# EAGLE design carrier (EAGLE 6.6.0)
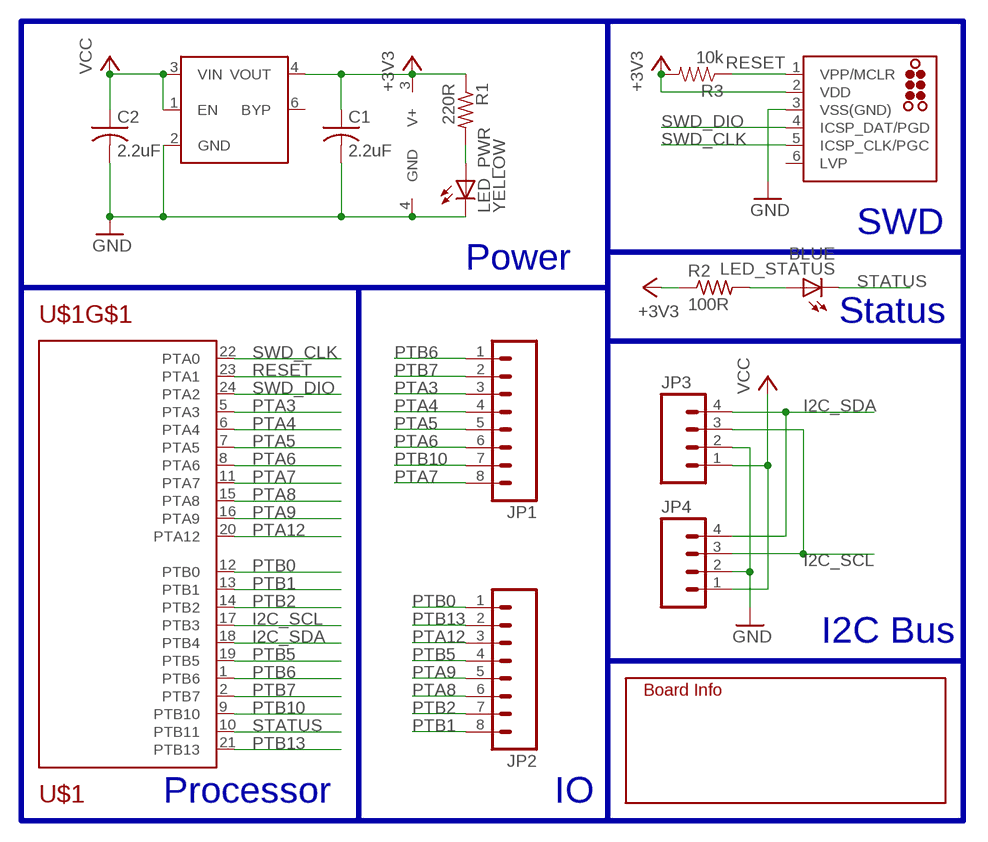
[diagram p0: schematic, sheet 1]

## Parts
C1  2.2uF  C-USC0402  [C0402]
C2  2.2uF  C-USC0402  [C0402]
J1  TC2030-MCP-NL  [TC2030-MCP-NL]
JP1  M081X08  [1X08]
JP2  M081X08  [1X08]
JP3  M04PTH  [1X04]
JP4  M04PTH  [1X04]
LED_PWR  YELLOW  LEDSML0603  [SML0603]
LED_STATUS  BLUE  LEDSML0603  [SML0603]
R1  220R  R-US_R0402  [R0402]
R2  100R  R-US_R0402  [R0402]
R3  10k  RESISTOR0402-RES  [0402-RES]
U$1  MKL05Z32VFK4-QFN  [QFN-24]
U$2  MIC5305-MLF  [MLF-6]
U$3  INFO  [INFO]

## Nets
+3V3: C1.1 J1.2(VDD) R1.1 R2.1 R3.2 U$1.3(V+) U$2.4(VOUT)
GND: C1.2 C2.2 J1.3(VSS(GND)) JP3.2 JP4.2 LED_PWR.C U$1.4(GND) U$2.2(GND)
I2C_SCL: JP3.3 JP4.3 U$1.17(PTB3)
I2C_SDA: JP3.4 JP4.4 U$1.18(PTB4)
N$1: LED_PWR.A R1.2
N$2: LED_STATUS.A R2.2
PTA3: JP1.3 U$1.5(PTA3)
PTA4: JP1.4 U$1.6(PTA4)
PTA5: JP1.5 U$1.7(PTA5)
PTA6: JP1.6 U$1.8(PTA6)
PTA7: JP1.8 U$1.11(PTA7)
PTA8: JP2.6 U$1.15(PTA8)
PTA9: JP2.5 U$1.16(PTA9)
PTA12: JP2.3 U$1.20(PTA12)
PTB0: JP2.1 U$1.12(PTB0)
PTB1: JP2.8 U$1.13(PTB1)
PTB2: JP2.7 U$1.14(PTB2)
PTB5: JP2.4 U$1.19(PTB5)
PTB6: JP1.1 U$1.1(PTB6)
PTB7: JP1.2 U$1.2(PTB7)
PTB10: JP1.7 U$1.9(PTB10)
PTB13: JP2.2 U$1.21(PTB13)
RESET: J1.1(VPP/MCLR) R3.1 U$1.23(PTA1)
STATUS: LED_STATUS.C U$1.10(PTB11)
SWD_CLK: J1.5(ICSP_CLK/PGC) U$1.22(PTA0)
SWD_DIO: J1.4(ICSP_DAT/PGD) U$1.24(PTA2)
VCC: C2.1 JP3.1 JP4.1 U$2.1(EN) U$2.3(VIN)
Unconnected: J1.6(LVP) U$2.6(BYP)

## Buses
B$1

## Notes on the sheet
- SWD
- Power
- Status
- I2C Bus
- Processor | IO

## Library data of the parts
C1 C2 = rcl:C-US: CAPACITOR, American symbol
J1 = tag-connect:TC2030: TAG-CONNECT ICSP Connector Manufacturer: Tag-Connect <http://www.tag-connect.com> Cable for easy In-Circuit Serial Programming. Designed for Microchip ICD2, suitable for many others. Two variants - one "with legs" (for hands-free fit on PCB) and another "without legs" for quick programming. PAD Description 1 MCLR/Vpp 2 Vdd 3 GND 4 PGD (ISPDAT) 5 PGC (ISPCLK) 6 nc (used for LVP) ©2009 ROFA.cz - modified and updated by Robert Darlington ‹rdarlington@gmail.com›
JP1 JP2 = SparkFun-Connectors:M08: Header 8 Standard 8-pin 0.1" header. Use with straight break away headers (SKU : PRT-00116), right angle break away headers (PRT-00553), swiss pins (PRT-00743), machine pins (PRT-00117), and female headers (PRT-00115).
JP3 JP4 = SparkFun-Connectors:M04: Header 4 Standard 4-pin 0.1" header. Use with straight break away headers (SKU : PRT-00116), right angle break away headers (PRT-00553), swiss pins (PRT-00743), machine pins (PRT-00117), and female headers (PRT-00115). Molex polarized connector foot print use with SKU : PRT-08231 with associated crimp pins and housings. 1MM SMD Version SKU: PRT-10208
LED_PWR LED_STATUS = led:LED: LED OSRAM: - CHIPLED LG R971, LG N971, LY N971, LG Q971, LY Q971, LO R971, LY R971 LH N974, LH R974 LS Q976, LO Q976, LY Q976 LO Q996 - Hyper CHIPLED LW Q18S LB Q993, LB Q99A, LB R99A - SideLED LS A670, LO A670, LY A670, LG A670, LP A670 LB A673, LV A673, LT A673, LW A673 LH A674 LY A675 LS A676, LA A676, LO A676, LY A676, LW A676 LS A679, LY A679, LG A679 - Hyper Micro SIDELED® LS Y876, LA Y876, LO Y876, LY Y876 LT Y87S - SmartLED LW L88C, LW L88S LB L89C, LB L89S, LG L890 LS L89K, LO L89K, LY L89K LS L896, LA L896, LO L896, LY L896 - TOPLED LS T670, LO T670, LY T670, LG T670, LP T670 LSG T670, LSP T670, LSY T670, LOP T670, LYG T670 LG T671, LOG T671, LSG T671 LB T673, LV T673, LT T673, LW T673 LH T674 LS T676, LA T676, LO T676, LY T676, LB T676, LH T676, LSB T676, LW T676 LB T67C, LV T67C, LT T67C, LS T67K, LO T67K, LY T67K, LW E67C LS E67B, LA E67B, LO E67B, LY E67B, LB E67C, LV E67C, LT E67C LW T67C LS T679, LY T679, LG T679 LS T770, LO T770, LY T770, LG T770, LP T770 LB T773, LV T773, LT T773, LW T773 LH T774 LS E675, LA E675, LY E675, LS T675 LS T776, LA T776, LO T776, LY T776, LB T776 LHGB T686 LT T68C, LB T68C - Hyper Mini TOPLED® LB M676 - Mini TOPLED Santana® LG M470 LS M47K, LO M47K, LY M47K Source: http://www.osram.convergy.de LUXEON: - LUMILED® LXK2-PW12-R00, LXK2-PW12-S00, LXK2-PW14-U00, LXK2-PW14-V00 LXK2-PM12-R00, LXK2-PM12-S00, LXK2-PM14-U00 LXK2-PE12-Q00, LXK2-PE12-R00, LXK2-PE12-S00, LXK2-PE14-T00, LXK2-PE14-U00 LXK2-PB12-K00, LXK2-PB12-L00, LXK2-PB12-M00, LXK2-PB14-N00, LXK2-PB14-P00, LXK2-PB14-Q00 LXK2-PR12-L00, LXK2-PR12-M00, LXK2-PR14-Q00, LXK2-PR14-R00 LXK2-PD12-Q00, LXK2-PD12-R00, LXK2-PD12-S00 LXK2-PH12-R00, LXK2-PH12-S00 LXK2-PL12-P00, LXK2-PL12-Q00, LXK2-PL12-R00 Source: www.luxeon.com KINGBRIGHT: KA-3528ASYC Source: www.kingbright.com
R1 R2 = rcl:R-US_: RESISTOR, American symbol
R3 = biomimetic:RESISTOR: Resistor Basic schematic elements and footprints for 0603, 1206, and PTH resistors.
U$1 = modular_robotics:MKL05Z32VFK4
U$2 = modular_robotics:MIC5305
U$3 = modular_robotics:INFO; AUTHOR: abuchan@berkeley.edu; DATE: 2015_07_14; DESIGN: MODROB_CARRIER; ORGANIZATION: UC Berkely ASPIRE; REVISION: r0.0

## Board
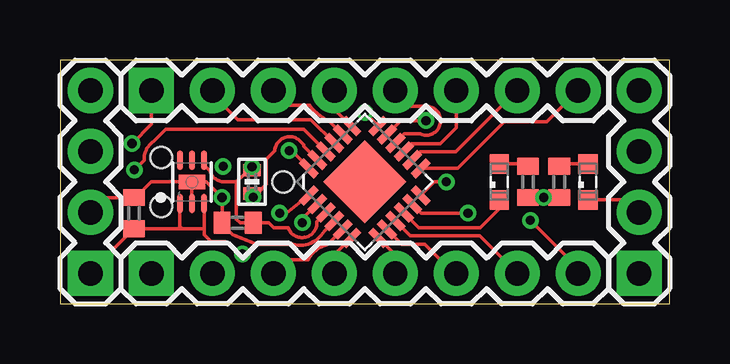
[diagram p1: board, top side]
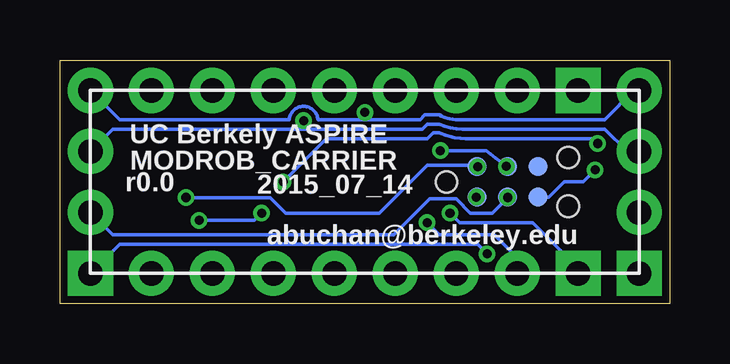
[diagram p2: board, bottom side, seen from below]

Size 25.4 x 10.16 mm. Coordinates in mm from the lower left corner, seen from the top.
Outline: 25.4,0 25.4,10.16 0,10.16 0,0 25.4,0
Copper layers (1*16): Top 0.035mm / dielectric 1.5mm / Bottom 0.035mm
Design rules "default *": minimum track width 6mil, minimum drill 15mil, track to track 6mil, track to pad 6mil, pad to pad 6mil, via to via 6mil, smd to smd 6mil, copper to edge 6mil, drill to drill 6mil, minimum pad ring 6mil, minimum via ring 6mil, stop-mask expansion 4mil, vias tented up to drill 0mil, thermal gap 10mil
bKeepout: area 2.9,3 to 10.6,7.1

### Footprints (pad centres in the part's own frame; a part is rotated, then mirrored left to right if it is on the bottom)
C0402 = smd 0.7 x 0.9: 1 -0.65,0; 2 0.65,0
TC2030-MCP-NL = smd 0.787 x 0.787: 1 1.27,-0.635; 2 1.27,0.635; 3 2.54,-0.635; 4 2.54,0.635; 5 3.81,-0.635; 6 3.81,0.635 | hole 0.889: 0,0; 5.08,-1.016; 5.08,1.016
1X08 = drill 1.016 pad 1.88 square: 1 0,0 | drill 1.016 pad 1.88: 2 2.54,0; 3 5.08,0; 4 7.62,0; 5 10.16,0; 6 12.7,0; 7 15.24,0; 8 17.78,0
1X04 = drill 1.016 pad 1.88 square: 1 0,0 | drill 1.016 pad 1.88: 2 2.54,0; 3 5.08,0; 4 7.62,0
SML0603 = smd 0.8 x 0.8: A 0.75,0; C -0.75,0
R0402 = smd 0.7 x 0.9: 1 -0.65,0; 2 0.65,0
0402-RES = smd 0.508 x 0.711: 1 -0.483,0; 2 0.483,0
QFN-24 = smd 0.9 x 0.3: 1 -2.05,1.25; 2 -2.05,0.75; 3 -2.05,0.25; 4 -2.05,-0.25; 5 -2.05,-0.75; 6 -2.05,-1.25; 13 2.05,-1.25; 14 2.05,-0.75; 15 2.05,-0.25; 16 2.05,0.25; 17 2.05,0.75; 18 2.05,1.25 | smd 0.3 x 0.9: 7 -1.25,-2.05; 8 -0.75,-2.05; 9 -0.25,-2.05; 10 0.25,-2.05; 11 0.75,-2.05; 12 1.25,-2.05; 19 1.25,2.05; 20 0.75,2.05; 21 0.25,2.05; 22 -0.25,2.05; 23 -0.75,2.05; 24 -1.25,2.05 | smd 2.45 x 2.45: EP 0,0
MLF-6 = smd 0.25 x 0.8: 1 -0.5,-0.9; 2 0,-0.9; 3 0.5,-0.9; 4 0.5,0.9; 5 0,0.9; 6 -0.5,0.9 | smd 1.1 x 0.6: EPAD 0,0

### Placement (x,y rotation side)
C1  7.4,3.38 180 top
C2  3.08,3.78 90 top
J1  9.3,5.08 0 bottom
JP1  3.81,1.27 0 top
JP2  3.81,8.89 0 top
JP3  24.13,1.27 90 top
JP4  1.27,1.27 90 top
LED_PWR  22,5.08 90 top
LED_STATUS  18.3,5.08 90 top
R1  20.8,5.08 90 top
R2  19.5,5.08 90 top
R3  8,5.08 90 top
U$1  12.7,5.08 45 top
U$2  5.5,5.08 0 top
U$3  2.79,-3.81 0 bottom  (outside the outline)

### Tracks (layer width: path | path; a pad name or v marks a point on that pad's centre or on a via)
+3V3  (via drill 0.38)
  Top 0.152: 7.35,5.08 v8,5.71 R3.2 | 7.35,5.08 7.35,3.53 7.5,3.38 C1.1 8.7,3.38 8.9,3.18 9.5,3.18 arc166 10.7,3.43 U$1.3 | 7.35,5.08 6.8,5.08 arc-67 6.25,5.53 6,5.78 U$2.4 | R1.1 v20.15,4.43 R2.1
  Bottom 0.152: J1.2 v8,5.71 8.07,5.78 10.1,5.78 12.1,3.78 16,3.78 16.65,4.43 v20.15,4.43
GND  (via drill 0.38)
  Top 0.152: C1.2 v6.75,4.43 6.1,5.08 5.5,5.08 | 6.75,3.13 C1.2 | U$2.2 5.5,5.08 | 5.5,5.08 3.8,5.08 3.15,4.43 C2.2 1.89,4.43 JP4.2 | C1.2 6.75,3.33 7.2,2.88 8.2,2.48 9.7,2.48 arc77 11,3.03 U$1.4 | LED_PWR.C 23.61,4.33 JP3.2
  Bottom 0.152: JP3.2 23.2,2.88 11.5,2.88 10,4.38 8.9,4.38 8.3,3.78 7.4,3.78 v6.75,4.43 v6.75,4.44 J1.3
I2C_SCL  (via drill 0.38)
  Top 0.152: U$1.17 14.19,7.63 v15.25,7.63
  Bottom 0.152: JP4.3 1.77,6.35 2.7,7.28 8.4,7.28 arc22 9.6,7.48 10.1,7.48 10.3,7.28 15.3,7.28 | 15.3,7.28 23.2,7.28 JP3.3 | v15.25,7.63 15.25,7.33 15.3,7.28
I2C_SDA  (via drill 0.38)
  Top 0.152: U$1.18 v12.7,7.98
  Bottom 0.152: JP4.4 1.49,8.89 2.7,7.68 8.8,7.68 arc34 9.6,7.88 10.2,7.88 10.4,7.68 12.8,7.68 | 12.8,7.68 14.65,7.68 arc-170 15.85,7.68 22.92,7.68 JP3.4 | v12.7,7.98 12.7,7.78 12.8,7.68
N$1
  Top 0.152: LED_PWR.A 20.9,5.83 R1.2
N$2
  Top 0.152: LED_STATUS.A 19.4,5.83 R2.2
PTA3
  Top 0.152: U$1.5 11.16,2.48 10.9,2.38 arc42 10.35,1.83 9.45,1.83 JP1.3
PTA4
  Top 0.152: U$1.6 11.43,2.04 JP1.4
PTA5
  Top 0.152: U$1.7 13.97,2.04 JP1.5
PTA6
  Top 0.152: U$1.8 14.24,2.48 15.2,2.48 16.41,1.27 JP1.6
PTA7  (via drill 0.38)
  Top 0.152: U$1.11 15.06,3.78 v17,3.78 | v19.6,3.48 21.59,1.49 JP1.8
  Bottom 0.152: v17,3.78 17.3,3.48 v19.6,3.48
PTA8
  Top 0.152: U$1.15 14.65,6.68 15.85,6.68 16.51,7.34 JP2.6
PTA9
  Top 0.152: U$1.16 14.35,7.08 15,7.08 arc195 15.35,8.23 14.63,8.23 JP2.5
PTA12
  Top 0.152: U$1.20 11.16,7.68 11.1,7.68 arc-28 10.4,8.28 9.5,8.28 JP2.3
PTB0  (via drill 0.38)
  Top 0.152: JP2.1 3.81,7.49 v3,6.68 | 15.1,4.58 U$1.12 15.6,5.08 v16.1,5.08
  Bottom 0.152: v3,6.68 3.2,6.88 8.5,6.88 arc22 9.6,7.13 9.85,7.13 10.1,6.88 14.3,6.88 v16.1,5.08
PTB1
  Top 0.152: U$1.13 16.57,5.65 18.5,7.58 20.28,7.58 JP2.8
PTB2
  Top 0.152: U$1.14 15.01,6.33 16.49,6.33 JP2.7
PTB5
  Top 0.152: U$1.19 11.43,8.12 JP2.4
PTB6  (via drill 0.38)
  Top 0.152: U$1.1 9.43,3.78 v9.15,3.78
  Bottom 0.152: 3.81,1.29 JP1.1 3.81,1.49 5.7,3.38 8.75,3.38 v9.15,3.78
PTB7  (via drill 0.38)
  Top 0.152: U$1.2 10.1,3.54 v10.1,3.38
  Bottom 0.152: v10.1,3.38 9.6,2.88 7.3,2.88 6.35,1.93 JP1.2
PTB10
  Top 0.152: U$1.9 14.6,2.83 17.49,2.83 JP1.7
PTB13
  Top 0.152: U$1.21 10.45,7.68 7.4,7.68 6.35,8.73 JP2.2
RESET  (via drill 0.38)
  Top 0.152: U$1.23 10.15,6.57 10.15,6.63 10.05,6.73 arc140 8.95,6.38 8.6,6.03 8.6,4.98 8.22,4.6 v8.05,4.45 8,4.5 R3.1
  Bottom 0.152: v8.05,4.45 J1.1
STATUS
  Top 0.152: U$1.10 14.95,3.18 17.5,3.18 18.25,3.93 18.25,4.33 LED_STATUS.C
SWD_CLK  (via drill 0.38)
  Top 0.152: U$1.22 10.15,7.28 4.4,7.28 3.9,6.78 arc49 3.5,6.08 3.5,5.98 v3.1,5.58
  Bottom 0.152: 5.49,4.47 J1.5 | 5.43,4.45 J1.5 | J1.5 5.03,4.45 4.4,5.08 3.6,5.08 v3.1,5.58
SWD_DIO  (via drill 0.38)
  Top 0.152: U$1.24 9.68,6.38 v9.55,6.38
  Bottom 0.152: v9.55,6.38 7.65,6.38 v6.8,5.73 6.77,5.73 J1.4
VCC  (via drill 0.38)
  Top 0.152: v7.6,2.08 7.4,2.08 6.9,2.58 6.3,2.58 6,2.88 6,3.08 | 6,3.08 U$2.3 | 5.1,3.13 C2.1 1.27,1.32 JP4.1 | 5.1,3.13 5.95,3.13 6,3.08 | U$2.1 5,3.23 5.1,3.13
  Bottom 0.152: JP3.1 22.91,2.49 8,2.48 v7.6,2.08